# EAGLE schematic PROFIBUS_V5 (EAGLE 6.4)
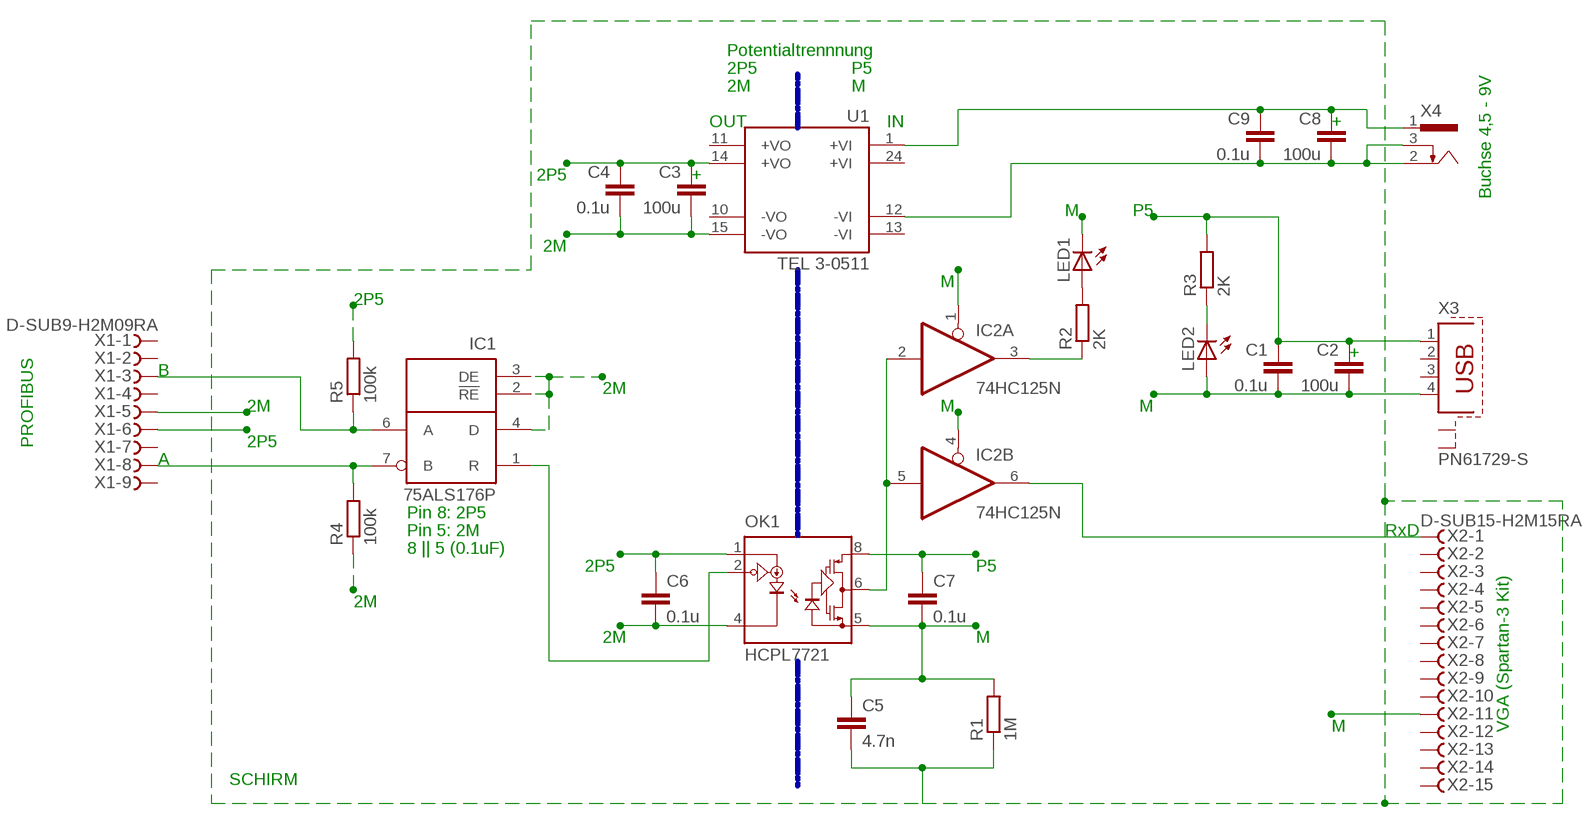
[diagram p0: schematic, sheet 1]

## Parts
C1  0.1u  C2,5-3  [C2.5-3]
C2  100u  C2,5-3  [C2.5-3]
C3  100u  C2,5-3  [C2.5-3]
C4  0.1u  C2,5-3  [C2.5-3]
C5  4.7n  C2,5-3  [C2.5-3]
C6  0.1u  C2,5-3  [C2.5-3]
C7  0.1u  C2,5-3  [C2.5-3]
C8  100u  C2,5-3  [C2.5-3]
C9  0.1u  C2,5-3  [C2.5-3]
IC1  75ALS176P  [DIL08]
IC2  74HC125N  [DIL14]
LED1  TLLY4400  [LED3MM]
LED2  TLLG4400  [LED3MM]
OK1  HCPL7721  [DIL08]
R1  1M  R-EU_0204/7  [0204/7]
R2  2K  R-EU_0204/7  [0204/7]
R3  2K  R-EU_0204/7  [0204/7]
R4  100k  R-EU_0204/7  [0204/7]
R5  100k  R-EU_0204/7  [0204/7]
U1  TEL 3-0511  AM3N-0505S  [AM3N_DIL24]
X1  D-SUB9-H2M09RA  [H2M09RA]
X2  D-SUB15-H2M15RA  [H2M15RA]
X3  PN61729-S  [PN61729-S]
X4  733980-62  [733980-62]

## Nets
+VO: C3.1 C4.1 U1.14(+VO)
-VO@2: C3.2 C4.2 U1.15(-VO)
N$1: IC1.7(B) R4.2 X1.8
N$2: IC1.6(A) R5.1 X1.3
N$3: IC1.1(R) OK1.2(VI)
N$4: IC2.2(A:I) IC2.5(B:I) OK1.6(VO)
N$5: IC1.2(!RE) IC1.3(DE) IC1.4(D)
N$6: C5.2 R1.1
N$7: LED2.K(C) R3.1
N$8: C1.2 C2.2 LED2.A X3.4
N$9: C6.1 OK1.1(VDD1)
N$10: C6.2 OK1.4(GND1)
N$11: C7.1 OK1.8(VDD2)
N$12: X2.11
N$13: R5.2
N$14: C5.1 C7.2 OK1.5(GND2) R1.2
N$15: R4.1
N$16: X1.6
N$17: X1.5
N$18: IC2.6(B:O) X2.1
N$19: LED1.A R2.2
N$20: LED1.K(C)
N$21: IC2.1(A:OE)
N$22: IC2.4(B:OE)
N$23: IC2.3(A:O) R2.1
N$25: C1.1 C2.1 R3.2 X3.1
N$27: C8.2 C9.2 U1.12(-VI) X4.2 X4.3
N$28: C8.1 C9.1 U1.1(+VI) X4.1
Unconnected: IC2.8(C:O) IC2.9(C:I) IC2.10(C:OE) IC2.11(D:O) IC2.12(D:I) IC2.13(D:OE) U1.10(-VO) U1.11(+VO) X1.1 X1.2 X1.4 X1.7 X1.9 X2.2 X2.3 X2.4 X2.5 X2.6 X2.7 X2.8 X2.9 X2.10 X2.12 X2.13 X2.14 X2.15 X3.2 X3.3 X3.S1 X3.S2

## Buses
B$1
B$2
B$3

## Notes on the sheet
- Potentialtrennnung
- 2P5 | P5
- 2M | M
- OUT | IN | +
- 2P5 | +
- Buchse 4,5 - 9V
- M | P5
- 2M
- M
- 2P5
- +
- B
- 2M
- 2M | M | M
- PROFIBUS | 2P5
- A
- Pin 8: 2P5
- Pin 5: 2M | RxD
- 8 || 5 (0.1uF)
- 2P5 | P5
- 2M
- 2M | M
- M | VGA (Spartan-3 Kit)
- SCHIRM

## Power pins joined to a net without a drawn wire
+VI: U1.24(+VI)
-VI: U1.13(-VI)
GND: IC1.5(GND) IC2.7(P:GND)
VCC: IC1.8(VCC) IC2.14(P:VCC)

## Library data of the parts
C1-C9 = capacitor-wima:C: CAPACITOR naming: grid - package width
IC1 = texas:75ALS176: DIFFERENTIAL BUS TRANSCEIVERS TIA/EIA-422-B, TIA/EIA-422-B + TIA/EIA-422-B TIA/EIA-422-B Operate at Data Rates up to 35 Mbaud Source: http://focus.ti.com/lit/ds/symlink/sn65als176.pdf; MF: TEXAS INSTRUMENTS; MPN: SN75ALS176P; OC_FARNELL: 1103021; OC_NEWARK: 60K6915
IC2 = 74xx-eu:74*125: Quad bus BUFFER, 3-state
LED1 = led:TLLY4400: Low Current (2mA) LED 3 mm Tinted Diffused Package color YELLOW Source: Data sheet <http://www.farnell.com/datasheets/391098.pdf>; MF: VISHAY SEMICONDUCTOR; OC_FARNELL: 1612439
LED2 = led:TLLG4400: Low Current (2mA) LED 3 mm Tinted Diffused Package color GREEN Source: Data sheet <http://www.farnell.com/datasheets/391098.pdf>; MF: VISHAY SEMICONDUCTOR; OC_FARNELL: 1612435
OK1 = optocoupler:HCPL772*: 40 ns Propagation Delay, CMOS Optocoupler *Pin 3 is the anode of the internal LED and must be left unconnected for guaranteed data sheet perfomance. Pin 7 is not connected internally. Source: HCPL7721.pdf; MF: AGILENT TECHNOLOGIES; MPN: HCPL-7721; OC_FARNELL: 143248; OC_NEWARK: 83F5124
R1-R5 = resistor:R-EU_: RESISTOR, European symbol
U1 = aimtec_am3n:AM3N-*S: aimtec AM3N Series: 3 W DC/DC-Converters; ±10% Input Range; DIL24-compatible AM3N-xxyyS: Single output; 1000 V I/O-isolation Packages: DIL24-compatible, metal Note: actual pin assignment depends on output configuration and i/o-isolation voltage, see description Source: http://www.aimtec.ca (DC-DC Converters Catalogue Rev. 1.1) Technologies: xx input voltage (V) yy output voltage (V) (S) Single output (none) 1000 V I/O-isolation voltage Author: Dipl.-Ing. FH Rainer Bayer HHN Hochschule Heilbronn (Heilbronn University), rainer.bayer@hs-heilbronn.de Ingenieurbüro ing-rb, mail@ing-rb.de
X1 = con-thomas-betts:D-SUB9-: D-Subminiatur Connector Source: Electronioc Interconnects European Edition 1998; OC_FARNELL: unknown; OC_NEWARK: unknown
X2 = con-thomas-betts:D-SUB15-: D-Subminiatur Connector Source: Electronioc Interconnects European Edition 1998; MPN: H2M15RA29B; OC_FARNELL: unknown; OC_NEWARK: 93F8395
X3 = con-berg:PN61729-S: BERG USB connector; OC_FARNELL: unknown; OC_NEWARK: unknown
X4 = con-conrad:73398?: FEMALE PRINT CONNECTOR Niedervolt-Steckverbinder Distributor Conrad